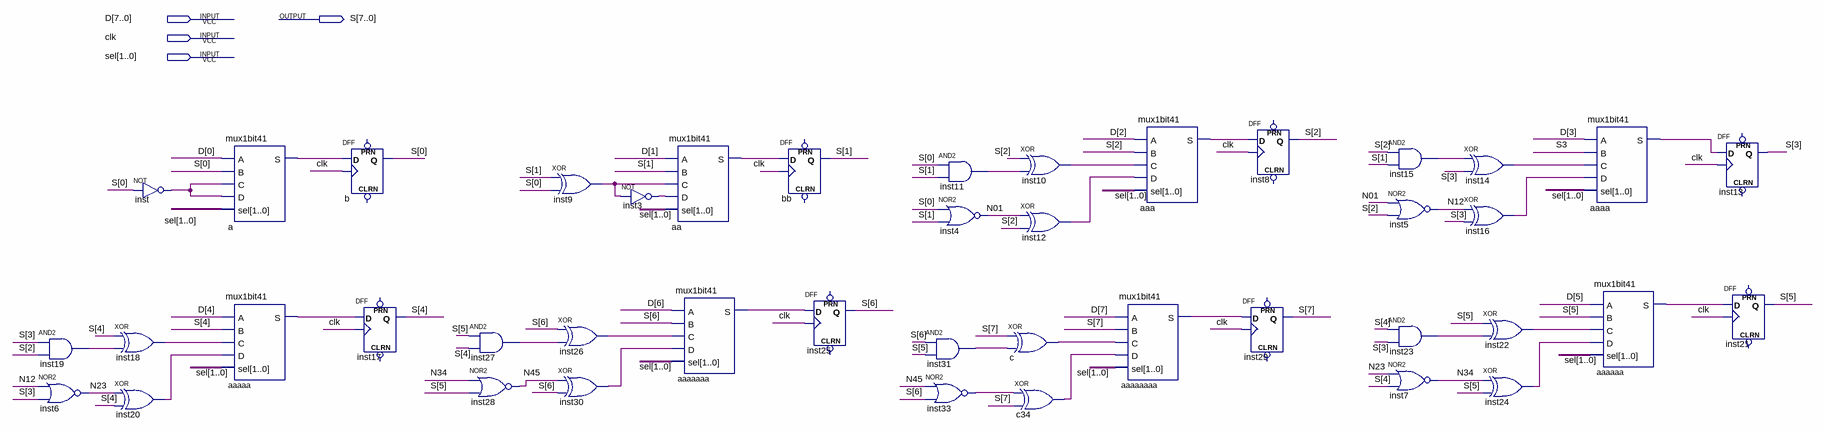
[diagram p0: schematic sheet]
// Quartus schematic CONTADOR.bdf as structural Verilog: 43 symbols, 4 pins
module CONTADOR (
  input  [7:0] D,
  input  clk,
  input  [1:0] sel,
  output [7:0] S
);

  wire a_s, aa_s, aaa_s, aaaa_s, aaaaa_s, aaaaaa_s, aaaaaaa_s, aaaaaaaa_s, c34_out, c_out, inst3_out,
       inst9_out, inst10_out, inst11_out, inst12_out, inst14_out, inst15_out, inst16_out, inst18_out,
       inst19_out, inst20_out, inst22_out, inst23_out, inst24_out, inst26_out, inst27_out, inst30_out,
       inst31_out, inst33_out, inst_out, N01, N12, N23, N34, N45;

  and inst19 (inst19_out, S[3], S[2]);
  nor inst6 (N23, N12, S[3]);
  not inst (inst_out, S[0]);
  xor inst18 (inst18_out, S[4], inst19_out);
  xor inst20 (inst20_out, N23, S[4]);
  mux1bit41 a (.A(D[0]), .B(S[0]), .C(inst_out), .D(inst_out), .sel(sel), .S(a_s));
  mux1bit41 aaaaa (.A(D[4]), .B(S[4]), .C(inst18_out), .D(inst20_out), .sel(sel), .S(aaaaa_s));
  DFF b (.CLK(clk), .D(a_s), .Q(S[0]));  // open: CLRN, PRN
  DFF inst17 (.CLK(clk), .D(aaaaa_s), .Q(S[4]));  // open: CLRN, PRN
  and inst27 (inst27_out, S[5], S[4]);
  nor inst28 (N45, N34, S[5]);
  xor inst9 (inst9_out, S[1], S[0]);
  xor inst26 (inst26_out, S[6], inst27_out);
  xor inst30 (inst30_out, N45, S[6]);
  mux1bit41 aa (.A(D[1]), .B(S[1]), .C(inst9_out), .D(inst3_out), .sel(sel), .S(aa_s));
  not inst3 (inst3_out, inst9_out);
  mux1bit41 aaaaaaa (.A(D[6]), .B(S[6]), .C(inst26_out), .D(inst30_out), .sel(sel), .S(aaaaaaa_s));
  DFF bb (.CLK(clk), .D(aa_s), .Q(S[1]));  // open: CLRN, PRN
  DFF inst25 (.CLK(clk), .D(aaaaaaa_s), .Q(S[6]));  // open: CLRN, PRN
  and inst11 (inst11_out, S[0], S[1]);
  nor inst4 (N01, S[0], S[1]);
  and inst31 (inst31_out, S[6], S[5]);
  nor inst33 (inst33_out, N45, S[6]);
  xor inst10 (inst10_out, S[2], inst11_out);
  xor inst12 (inst12_out, N01, S[2]);
  xor c (c_out, S[7], inst31_out);
  xor c34 (c34_out, inst33_out, S[7]);
  mux1bit41 aaaaaaaa (.A(D[7]), .B(S[7]), .C(c_out), .D(c34_out), .sel(sel), .S(aaaaaaaa_s));
  mux1bit41 aaa (.A(D[2]), .B(S[2]), .C(inst10_out), .D(inst12_out), .sel(sel), .S(aaa_s));
  DFF inst8 (.CLK(clk), .D(aaa_s), .Q(S[2]));  // open: CLRN, PRN
  DFF inst29 (.CLK(clk), .D(aaaaaaaa_s), .Q(S[7]));  // open: CLRN, PRN
  and inst15 (inst15_out, S[2], S[1]);
  nor inst5 (N12, N01, S[2]);
  and inst23 (inst23_out, S[4], S[3]);
  nor inst7 (N34, N23, S[4]);
  xor inst14 (inst14_out, inst15_out, S[3]);
  xor inst16 (inst16_out, N12, S[3]);
  xor inst22 (inst22_out, S[5], inst23_out);
  xor inst24 (inst24_out, N34, S[5]);
  mux1bit41 aaaa (.A(D[3]), .B(S[3]), .C(inst14_out), .D(inst16_out), .sel(sel), .S(aaaa_s));
  mux1bit41 aaaaaa (.A(D[5]), .B(S[5]), .C(inst22_out), .D(inst24_out), .sel(sel), .S(aaaaaa_s));
  DFF inst13 (.CLK(clk), .D(aaaa_s), .Q(S[3]));  // open: CLRN, PRN
  DFF inst21 (.CLK(clk), .D(aaaaaa_s), .Q(S[5]));  // open: CLRN, PRN
endmodule
